# Altium schematic sheet main.SchDoc
size A2; SheetNumber: 1; SheetTotal: 4
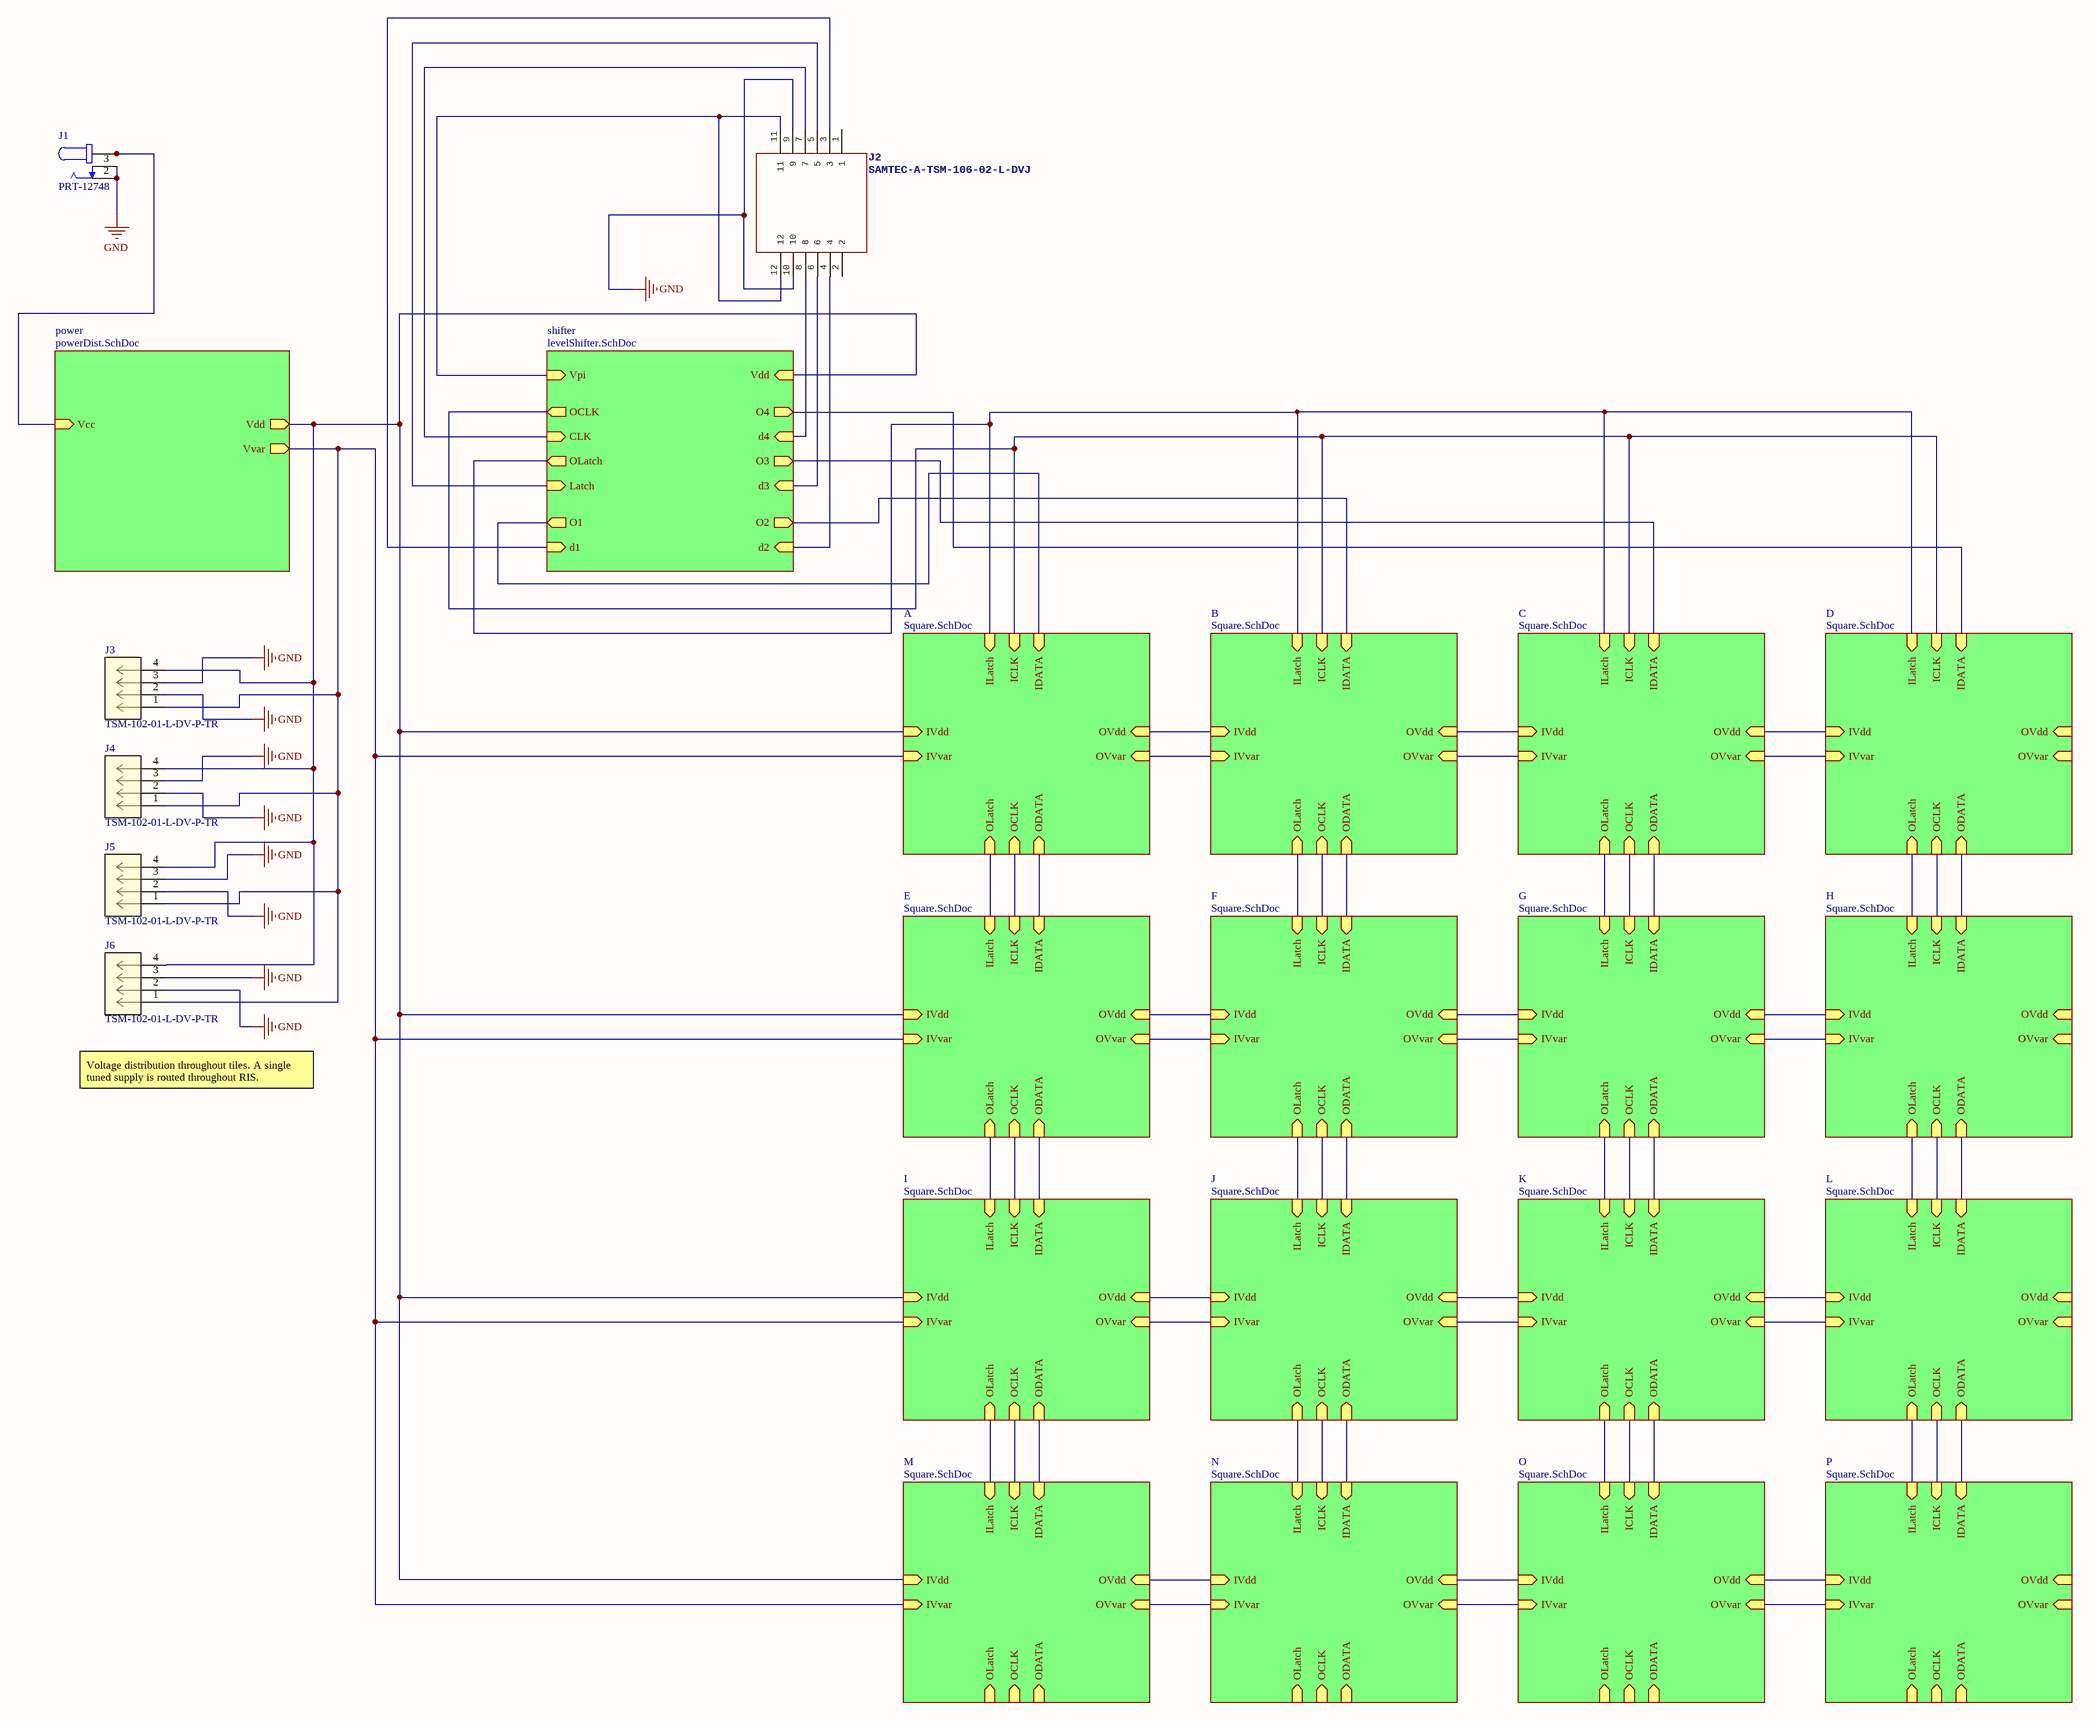
[diagram p0: main.SchDoc]

## Parts
J1  PRT-12748  [SPARKFUN_PRT-12748]
J2  SAMTEC-A-TSM-106-02-L-DVJ  [SAMTEC-A-TSM-106-02-L-DV]
J3  TSM-102-01-L-DV-P-TR  [SAMTEC-A-TSM-102-02-L-DV]
J4  TSM-102-01-L-DV-P-TR  [SAMTEC-A-TSM-102-02-L-DV]
J5  TSM-102-01-L-DV-P-TR  [SAMTEC-A-TSM-102-02-L-DV]
J6  TSM-102-01-L-DV-P-TR  [SAMTEC-A-TSM-102-02-L-DV]

## Sub-sheets
A = Square.SchDoc: IVvar (in), IVdd (in), IDATA (in), ICLK (in), ILatch (in), OLatch (in), OCLK (in), ODATA (in), OVvar (in), OVdd (in)
B = Square.SchDoc: IVvar (in), IVdd (in), IDATA (in), ICLK (in), ILatch (in), OLatch (in), OCLK (in), ODATA (in), OVvar (in), OVdd (in)
C = Square.SchDoc: IVvar (in), IVdd (in), IDATA (in), ICLK (in), ILatch (in), OLatch (in), OCLK (in), ODATA (in), OVvar (in), OVdd (in)
D = Square.SchDoc: IVvar (in), IVdd (in), IDATA (in), ICLK (in), ILatch (in), OLatch (in), OCLK (in), ODATA (in), OVvar (in), OVdd (in)
E = Square.SchDoc: IVvar (in), IVdd (in), IDATA (in), ICLK (in), ILatch (in), OLatch (in), OCLK (in), ODATA (in), OVvar (in), OVdd (in)
F = Square.SchDoc: IVvar (in), IVdd (in), IDATA (in), ICLK (in), ILatch (in), OLatch (in), OCLK (in), ODATA (in), OVvar (in), OVdd (in)
G = Square.SchDoc: IVvar (in), IVdd (in), IDATA (in), ICLK (in), ILatch (in), OLatch (in), OCLK (in), ODATA (in), OVvar (in), OVdd (in)
H = Square.SchDoc: IVvar (in), IVdd (in), IDATA (in), ICLK (in), ILatch (in), OLatch (in), OCLK (in), ODATA (in), OVvar (in), OVdd (in)
I = Square.SchDoc: IVvar (in), IVdd (in), IDATA (in), ICLK (in), ILatch (in), OLatch (in), OCLK (in), ODATA (in), OVvar (in), OVdd (in)
J = Square.SchDoc: IVvar (in), IVdd (in), IDATA (in), ICLK (in), ILatch (in), OLatch (in), OCLK (in), ODATA (in), OVvar (in), OVdd (in)
K = Square.SchDoc: IVvar (in), IVdd (in), IDATA (in), ICLK (in), ILatch (in), OLatch (in), OCLK (in), ODATA (in), OVvar (in), OVdd (in)
L = Square.SchDoc: IVvar (in), IVdd (in), IDATA (in), ICLK (in), ILatch (in), OLatch (in), OCLK (in), ODATA (in), OVvar (in), OVdd (in)
M = Square.SchDoc: IVvar (in), IVdd (in), IDATA (in), ICLK (in), ILatch (in), OLatch (in), OCLK (in), ODATA (in), OVvar (in), OVdd (in)
N = Square.SchDoc: IVvar (in), IVdd (in), IDATA (in), ICLK (in), ILatch (in), OLatch (in), OCLK (in), ODATA (in), OVvar (in), OVdd (in)
O = Square.SchDoc: IVvar (in), IVdd (in), IDATA (in), ICLK (in), ILatch (in), OLatch (in), OCLK (in), ODATA (in), OVvar (in), OVdd (in)
P = Square.SchDoc: IVvar (in), IVdd (in), IDATA (in), ICLK (in), ILatch (in), OLatch (in), OCLK (in), ODATA (in), OVvar (in), OVdd (in)
power = powerDist.SchDoc: Vvar (out), Vdd (out), Vcc (in)
shifter = levelShifter.SchDoc: Vpi (in), Vdd (in), Latch (in), CLK (in), d2 (in), d3 (in), d4 (in), d1 (in), OCLK (out), OLatch (out), O1 (out), O2 (out), O3 (out), O4 (out)

## Nets
GND: J1.2 J1.3 J2.9 J2.10 J3.2 J3.3 J4.2 J4.3 J5.2 J5.3 J6.2 J6.3
NetJ1_1_1: J1.1_1 J1.1_2 ; sheet power/Vcc
NetJ2_3: J2.3 ; sheet shifter/d1
NetJ2_4: J2.4 ; sheet shifter/d2
NetJ2_5: J2.5 ; sheet shifter/Latch
NetJ2_6: J2.6 ; sheet shifter/d3
NetJ2_7: J2.7 ; sheet shifter/CLK
NetJ2_8: J2.8 ; sheet shifter/d4
NetJ2_11: J2.11 J2.12 ; sheet shifter/Vpi
NetJ3_1: J3.1 J4.1 J5.1 J6.1 ; sheet power/Vvar, sheet A/IVvar, sheet E/IVvar, sheet I/IVvar, sheet M/IVvar
NetJ3_4: J3.4 J4.4 J5.4 J6.4 ; sheet shifter/Vdd, sheet power/Vdd, sheet A/IVdd, sheet E/IVdd, sheet I/IVdd, sheet M/IVdd
(unnamed): sheet shifter/OCLK, sheet A/ICLK, sheet B/ICLK, sheet C/ICLK, sheet D/ICLK
(unnamed): sheet shifter/OLatch, sheet A/ILatch, sheet B/ILatch, sheet C/ILatch, sheet D/ILatch
(unnamed): sheet shifter/O1, sheet A/IDATA
(unnamed): sheet shifter/O2, sheet B/IDATA
(unnamed): sheet shifter/O3, sheet C/IDATA
(unnamed): sheet shifter/O4, sheet D/IDATA
(unnamed): sheet A/OLatch, sheet E/ILatch
(unnamed): sheet A/OCLK, sheet E/ICLK
(unnamed): sheet A/ODATA, sheet E/IDATA
(unnamed): sheet A/OVvar, sheet B/IVvar
(unnamed): sheet A/OVdd, sheet B/IVdd
(unnamed): sheet E/OLatch, sheet I/ILatch
(unnamed): sheet E/OCLK, sheet I/ICLK
(unnamed): sheet E/ODATA, sheet I/IDATA
(unnamed): sheet E/OVvar, sheet F/IVvar
(unnamed): sheet E/OVdd, sheet F/IVdd
(unnamed): sheet I/OLatch, sheet M/ILatch
(unnamed): sheet I/OCLK, sheet M/ICLK
(unnamed): sheet I/ODATA, sheet M/IDATA
(unnamed): sheet I/OVvar, sheet J/IVvar
(unnamed): sheet I/OVdd, sheet J/IVdd
(unnamed): sheet M/OVvar, sheet N/IVvar
(unnamed): sheet M/OVdd, sheet N/IVdd
(unnamed): sheet B/OLatch, sheet F/ILatch
(unnamed): sheet B/OCLK, sheet F/ICLK
(unnamed): sheet B/ODATA, sheet F/IDATA
(unnamed): sheet B/OVvar, sheet C/IVvar
(unnamed): sheet B/OVdd, sheet C/IVdd
(unnamed): sheet F/OLatch, sheet J/ILatch
(unnamed): sheet F/OCLK, sheet J/ICLK
(unnamed): sheet F/ODATA, sheet J/IDATA
(unnamed): sheet F/OVvar, sheet G/IVvar
(unnamed): sheet F/OVdd, sheet G/IVdd
(unnamed): sheet J/OLatch, sheet N/ILatch
(unnamed): sheet J/OCLK, sheet N/ICLK
(unnamed): sheet J/ODATA, sheet N/IDATA
(unnamed): sheet J/OVvar, sheet K/IVvar
(unnamed): sheet J/OVdd, sheet K/IVdd
(unnamed): sheet N/OVvar, sheet O/IVvar
(unnamed): sheet N/OVdd, sheet O/IVdd
(unnamed): sheet C/OLatch, sheet G/ILatch
(unnamed): sheet C/OCLK, sheet G/ICLK
(unnamed): sheet C/ODATA, sheet G/IDATA
(unnamed): sheet C/OVvar, sheet D/IVvar
(unnamed): sheet C/OVdd, sheet D/IVdd
(unnamed): sheet G/OLatch, sheet K/ILatch
(unnamed): sheet G/OCLK, sheet K/ICLK
(unnamed): sheet G/ODATA, sheet K/IDATA
(unnamed): sheet G/OVvar, sheet H/IVvar
(unnamed): sheet G/OVdd, sheet H/IVdd
(unnamed): sheet K/OLatch, sheet O/ILatch
(unnamed): sheet K/OCLK, sheet O/ICLK
(unnamed): sheet K/ODATA, sheet O/IDATA
(unnamed): sheet K/OVvar, sheet L/IVvar
(unnamed): sheet K/OVdd, sheet L/IVdd
(unnamed): sheet O/OVvar, sheet P/IVvar
(unnamed): sheet O/OVdd, sheet P/IVdd
(unnamed): sheet D/OLatch, sheet H/ILatch
(unnamed): sheet D/OCLK, sheet H/ICLK
(unnamed): sheet D/ODATA, sheet H/IDATA
(unnamed): sheet H/OLatch, sheet L/ILatch
(unnamed): sheet H/OCLK, sheet L/ICLK
(unnamed): sheet H/ODATA, sheet L/IDATA
(unnamed): sheet L/OLatch, sheet P/ILatch
(unnamed): sheet L/OCLK, sheet P/ICLK
(unnamed): sheet L/ODATA, sheet P/IDATA

Not connected (* = marked no-connect by the designer): J2 1 2

## Notes on the sheet
- Voltage distribution throughout tiles. A single tuned supply is routed throughout RIS.

## Library data of the parts
J1 = PRT-12748: SparkFun Accessories DC Barrel Power Jack Connector SMD; Package: None; SnapEDA_Link: https://www.snapeda.com/parts/PRT-12748/SparkFun/view-part/?ref=snap; Value: *; MP: PRT-12748; Availability: In Stock; MF: SparkFun; Price: None; Purchase-URL: https://pricing.snapeda.com/search/part/PRT-12748/?ref=eda; Check_prices: https://www.snapeda.com/parts/PRT-12748/SparkFun/view-part/?ref=eda
J3-J6 = TSM-102-01-L-DV-P-TR: No Description Available; Mfr_Name: Samtec Inc; Copyright: Copyright (C) 2022 Ultra Librarian. All rights reserved.; Manufacturer_Part_Number: TSM-102-01-L-DV-P-TR; RefDes: RefDes; Type: DEV